# Altium schematic sheet prec_5V_LDO.SchDoc
size A3; Organization: Altium Limited; Address1: L3, 12a Rodborough Rd; Address2: Frenchs Forest; Address3: NSW; Address4: Australia 2086
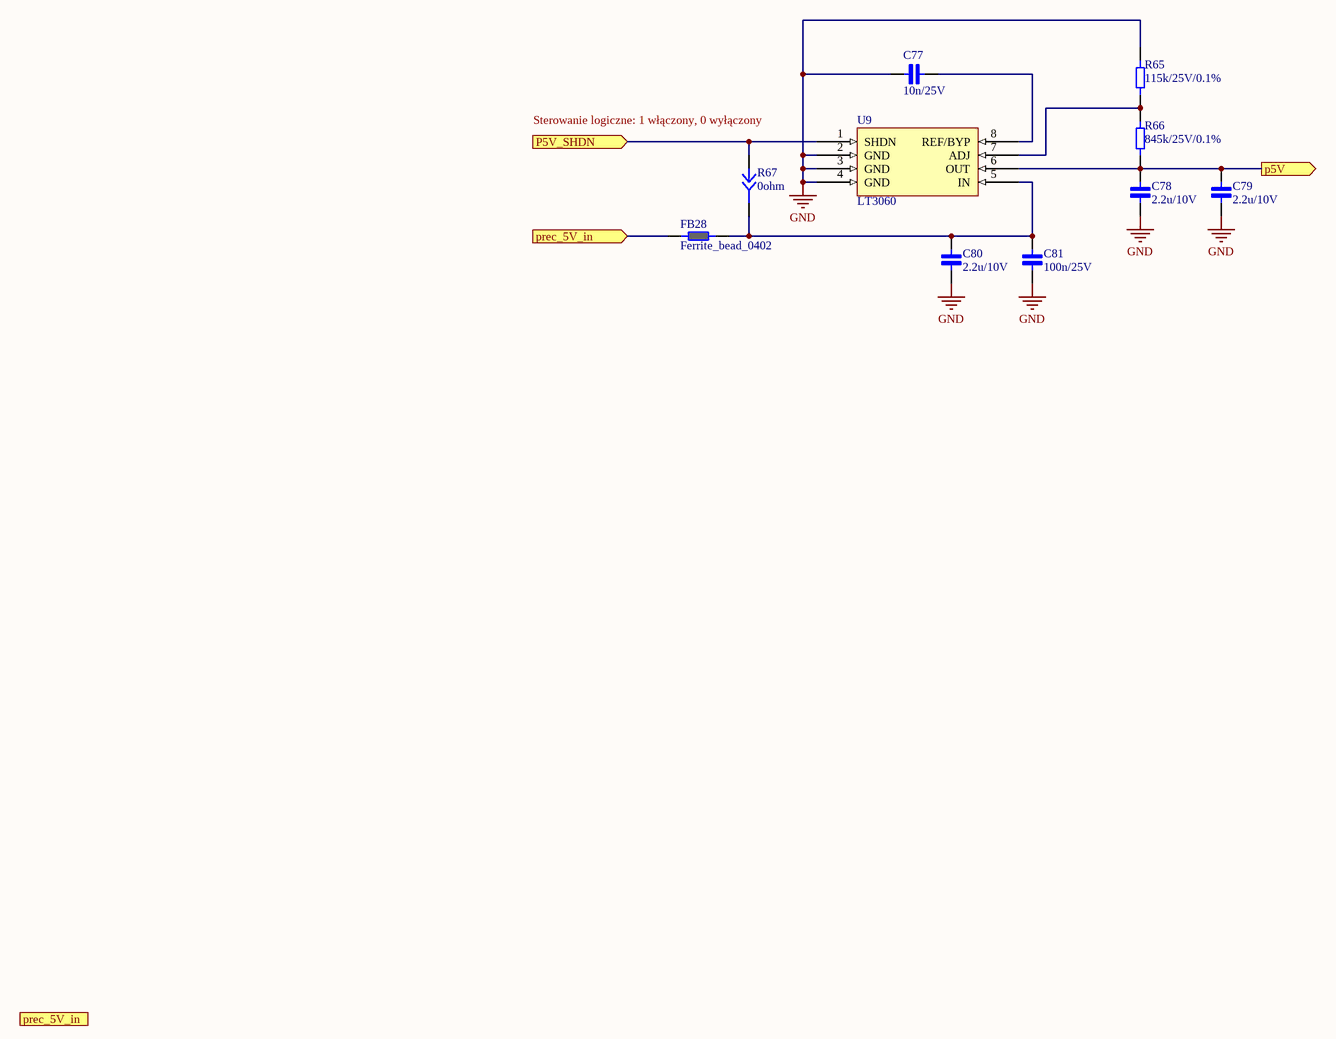
[diagram p0: prec_5V_LDO.SchDoc]

## Parts
C77  10n/25V  [Cap_0402]
C78  2.2u/10V  [Cap_0402]
C79  2.2u/10V  [Cap_0402]
C80  2.2u/10V  [Cap_0402]
C81  100n/25V  [Cap_0402]
FB28  Ferrite_bead_0402  [FERRITE_0402]
R65  115k/25V/0.1%  [RES_0402]
R66  845k/25V/0.1%  [RES_0402]
R67  0ohm  [Jumper 2]
U9  LT3060  [TS8]

## Ports
p5V (out), P5V_SHDN (in), prec_5V_in (in), prec_5V_in (out)

## Nets
GND: C77.2 C78.1 C79.1 C80.1 C81.1 R65.2 U9.2(GND) U9.3(GND) U9.4(GND)
p5V: C78.2 C79.2 R66.1 U9.6(OUT) ; port p5V
P5V_SHDN: R67.2 U9.1(SHDN) ; port P5V_SHDN
prec_5V_in: FB28.1 ; port prec_5V_in
NetC77_1: C77.1 U9.8(REF/BYP)
NetC80_2: C80.2 C81.2 FB28.2 R67.2 U9.5(IN)
NetR65_1: R65.1 R66.2 U9.7(ADJ)

## Notes on the sheet
- Sterowanie logiczne: 1 włączony, 0 wyłączony
- Title
- Size:
- Date:
- A3
- Number:
- Time:
- Revision:
- Sheet
- of
- File:

## Library data of the parts
C77 = Cap_0402_10n: Ceramic Capacitor 10n / 0402 / 25V / ±5%, Wurth Elektronik MLCC; ComponentLink1Description: New link; ComponentLink1URL: https://www.we-online.com/catalog/en/WCAP-CSGP-25VDC
C78-C80 = Cap_0402_2.2u: Ceramic Capacitor 2.2uF / 0402 / 10V / ±5%, Wurth Elektronik MLCC
C81 = Cap_0402_100n: Ceramic Capacitor 100n / 0402 / 25V / ±5%, Wurth Elektronik MLCC; ComponentLink1Description: New link; ComponentLink1URL: https://www.we-online.com/catalog/en/WCAP-CSGP-25VDC
FB28 = Ferrite_bead_0402: Ferrite bead, wurth 74269241102
R65 = Res_0402_115k: Vishay, thin film resistor 115k/25V/0.1%
R66 = Res_0402_845k: Vishay, thin film resistor 845k/25V/0.1%
R67 = Jumper
U9 = Lt3060: 45V VIN, Micropower, / Low Noise, 100mA Low / Dropout, Linear Regulator